# Altium schematic sheet Sensors.SchDoc
size A4; SheetNumber: 4; SheetTotal: 5
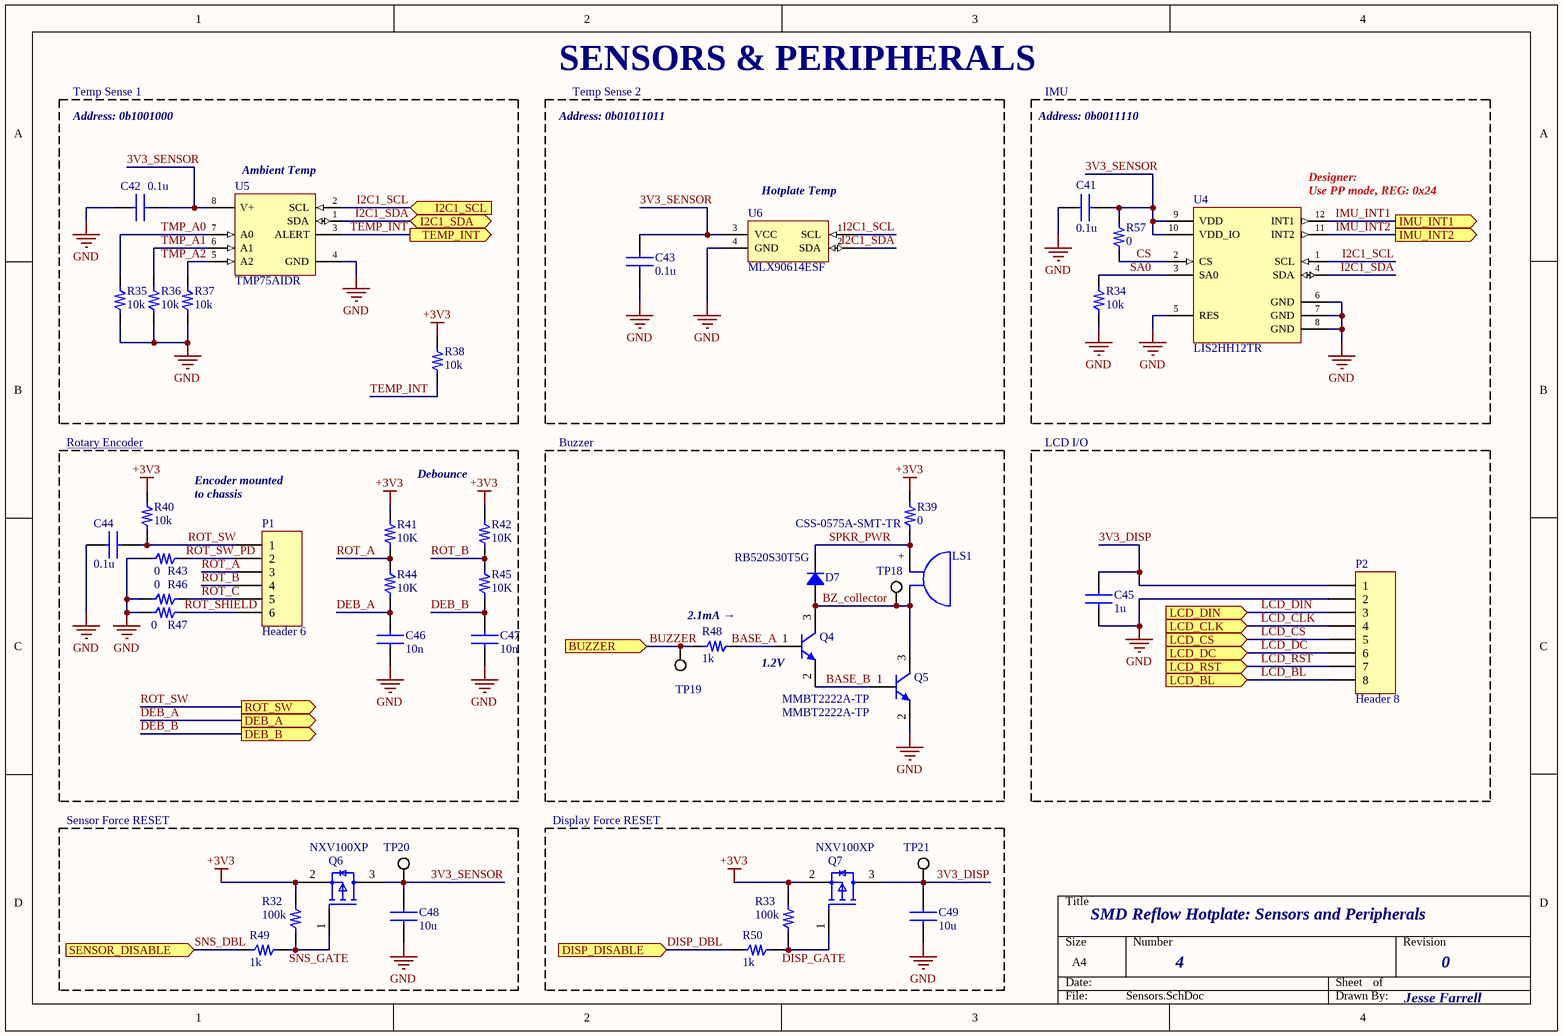
[diagram p0: Sensors.SchDoc]

## Parts
C41  0.1u  [FP-CL10-IPC_C]
C42  0.1u  [FP-CL10-IPC_C]
C43  0.1u  [FP-CL10-IPC_C]
C44  0.1u  [FP-CL10-IPC_C]
C45  1u  [FP-CL10-IPC_C]
C46  10n  [FP-CL10-IPC_C]
C47  10n  [FP-CL10-IPC_C]
C48  10u  [FP-CL10-IPC_C]
C49  10u  [FP-CL10-IPC_C]
D7  RB520S30T5G  [SOD-523]
LS1  CSS-0575A-SMT-TR  [CUI CSS-0575A-SMT-TR]
P1  Header 6  [HDR1X6]
P2  Header 8  [HDR1X8]
Q4  MMBT2222A-TP  [MCCSEMI SOT-23-3]
Q5  MMBT2222A-TP  [MCCSEMI SOT-23-3]
Q6  NXV100XP  [FP-SOT23-MFG - duplicate]
Q7  NXV100XP  [FP-SOT23-MFG - duplicate]
R32  100k  [FP-RMCF0603-MFG]
R33  100k  [FP-RMCF0603-MFG]
R34  10k  [FP-RMCF0603-MFG]
R35  10k  [FP-RMCF0603-MFG]
R36  10k  [FP-RMCF0603-MFG]
R37  10k  [FP-RMCF0603-MFG]
R38  10k  [FP-RMCF0603-MFG]
R39  0  [FP-RMCF0603-MFG]
R40  10k  [FP-RMCF0603-MFG]
R41  10K  [FP-RMCF0603-MFG]
R42  10K  [FP-RMCF0603-MFG]
R43  0  [FP-RMCF0603-MFG]
R44  10K  [FP-RMCF0603-MFG]
R45  10K  [FP-RMCF0603-MFG]
R46  0  [FP-RMCF0603-MFG]
R47  0  [FP-RMCF0603-MFG]
R48  1k  [FP-RMCF0603-MFG]
R49  1k  [FP-RMCF0603-MFG]
R50  1k  [FP-RMCF0603-MFG]
R57  0  [FP-RMCF0603-MFG]
TP18  TEST POINT  [KSTN-5003]  (value not drawn)
TP19  TEST POINT  [KSTN-5003]  (value not drawn)
TP20  TEST POINT  [KSTN-5003]  (value not drawn)
TP21  TEST POINT  [KSTN-5003]  (value not drawn)
U4  LIS2HH12TR  [STM-LGA-12]
U5  TMP75AIDR  [FP-D0008A-MFG]
U6  MLX90614ESF  [TO254P942H425-4]

## Blocks framed on the sheet
Temp Sense 1: C42 R35-R38 U5
Temp Sense 2: C43 U6
IMU: C41 R34 R57 U4
Rotary Encoder: C44 C46 C47 P1 R40-R47
Buzzer: D7 LS1 Q4 Q5 R39 R48 TP18 TP19
LCD I/O: C45 P2
Sensor Force RESET: C48 Q6 R32 R49 TP20
Display Force RESET: C49 Q7 R33 R50 TP21

## Ports
BUZZER (in), DEB_A (out), DEB_B (out), DISP_DISABLE (in), I2C1_SCL (in), I2C1_SDA (bidir), IMU_INT1 (out), IMU_INT2 (out), LCD_BL (in), LCD_CLK (in), LCD_CS (in), LCD_DC (in), LCD_DIN (in), LCD_RST (in), ROT_SW (out), SENSOR_DISABLE (in), TEMP_INT (out)

## Nets
+3V3: Q6.2(S) Q7.2(S) R32.2 R33.2 R38.1 R39.1 R40.1 R41.2 R42.2
GND: C41.1 C42.1 C43.1 C44.1 C45.1 C46.1 C47.1 C48.2 C49.2 P2.2 Q5.2(E) R34.2 R35.2 R36.2 R37.2 R43.1 R46.1 R47.1 U4.5(RES) U4.6(GND) U4.7(GND) U4.8(GND) U5.4(GND) U6.4(GND)
3V3_DISP: C45.2 C49.1 P2.1 Q7.3(D) TP21.1
3V3_SENSOR: C41.2 C42.2 C43.2 C48.1 Q6.3(D) R57.2 TP20.1 U4.9(VDD) U4.10(VDD_IO) U5.8(V+) U6.3(VCC)
BASE_A: Q4.1(B) R48.1
BASE_B: Q4.2(E) Q5.1(B)
BUZZER: R48.2 TP19.1 ; port BUZZER
BZ_collector: D7.1 LS1.- Q4.3(C) Q5.3(C) TP18.1
CS: R57.1 U4.2(CS)
DEB_A: C46.2 R44.2 ; port DEB_A
DEB_B: C47.2 R45.2 ; port DEB_B
DISP_DBL: R50.2 ; port DISP_DISABLE
DISP_GATE: Q7.1(G) R33.1 R50.1
I2C1_SCL: U4.1(SCL) U5.2(SCL) U6.1(SCL) ; port I2C1_SCL
I2C1_SDA: U4.4(SDA) U5.1(SDA) U6.2(SDA) ; port I2C1_SDA
IMU_INT1: U4.12(INT1) ; port IMU_INT1
IMU_INT2: U4.11(INT2) ; port IMU_INT2
LCD_BL: P2.8 ; port LCD_BL
LCD_CLK: P2.4 ; port LCD_CLK
LCD_CS: P2.5 ; port LCD_CS
LCD_DC: P2.6 ; port LCD_DC
LCD_DIN: P2.3 ; port LCD_DIN
LCD_RST: P2.7 ; port LCD_RST
ROT_A: P1.3 R41.1 R44.1
ROT_B: P1.4 R42.1 R45.1
ROT_C: P1.5 R46.2
ROT_SHIELD: P1.6 R47.2
ROT_SW: C44.2 P1.1 R40.2 ; port ROT_SW
ROT_SW_PD: P1.2 R43.2
SA0: R34.1 U4.3(SA0)
SNS_DBL: R49.2 ; port SENSOR_DISABLE
SNS_GATE: Q6.1(G) R32.1 R49.1
SPKR_PWR: D7.2 LS1.+ R39.2
TEMP_INT: R38.2 U5.3(ALERT) ; port TEMP_INT
TMP_A0: R35.1 U5.7(A0)
TMP_A1: R36.1 U5.6(A1)
TMP_A2: R37.1 U5.5(A2)

## Notes on the sheet
- SENSORS & PERIPHERALS
- Address: 0b1001000
- (near U5) Ambient Temp
- Address: 0b01011011
- Address: 0b0011110
- (near U6) Hotplate Temp
- (near U4) Designer:
  Use PP mode, REG: 0x24
- Encoder mounted
  to chassis
- Debounce
- 2.1mA →
- (near Q4) 1.2V
- SMD Reflow Hotplate: Sensors and Peripherals
- 4
- 0
- Jesse Farrell

## Library data of the parts
C41-C44 = CapTemplate0603: Cap Ceramic 0.1uF 16V X7R 10% SMD 0603; Supplier 1: Digi-Key; RoHS: Yes; Category: Ceramic Capacitors; Mount: Surface Mount; Case/Package: 0603; Case Code (Metric): 1608; Case Code (Imperial): 0603; Packaging: Tape and Reel; Capacitance: 0.1uF; Voltage Rating: 16V; Tolerance: 10%; Length: 0.063inch; Width: 0.031inch; Thickness: 0.035inch; ComponentLink1Description: DigikeyPart; ComponentLink1URL: https://www.digikey.ca/en/products/detail/samsung-electro-mechanics/CL10B104KO8NNNC/3886663
C45 = CapTemplate0603: Cap Ceramic 1uF 16V X5R 10% SMD 0603; Capacitance: 0.1uF; Supplier 1: Digi-Key; RoHS: Yes; Category: Ceramic Capacitors; Mount: Surface Mount; Case/Package: 0603; Case Code (Metric): 1608; Case Code (Imperial): 0603; Packaging: Tape and Reel; Voltage Rating: 16V; Tolerance: 10%; Length: 0.063inch; Width: 0.031inch; Thickness: 0.035inch; ComponentLink1Description: DigikeyPart; ComponentLink1URL: https://www.digikey.ca/en/products/detail/samsung-electro-mechanics/CL10B104KO8NNNC/3886663
C46 C47 = CapTemplate0603: Cap Ceramic 10nF 16V X7R 10% SMD 0603; Supplier 1: Digi-Key; RoHS: Yes; Category: Ceramic Capacitors; Mount: Surface Mount; Case/Package: 0603; Case Code (Metric): 1608; Case Code (Imperial): 0603; Packaging: Tape and Reel; Capacitance: 10nF; Voltage Rating: 16V; Tolerance: 10%; Length: 0.063inch; Width: 0.031inch; Thickness: 0.035inch; ComponentLink1Description: DigikeyPart; ComponentLink1URL: https://www.digikey.ca/en/products/detail/samsung-electro-mechanics/CL10B104KO8NNNC/3886663
C48 C49 = CapTemplate0603: Cap Ceramic 10uF 16V X5R 10% SMD 0603; Capacitance: 0.1uF; Supplier 1: Digi-Key; RoHS: Yes; Category: Ceramic Capacitors; Mount: Surface Mount; Case/Package: 0603; Case Code (Metric): 1608; Case Code (Imperial): 0603; Packaging: Tape and Reel; Voltage Rating: 16V; Tolerance: 10%; Length: 0.063inch; Width: 0.031inch; Thickness: 0.035inch; ComponentLink1Description: DigikeyPart; ComponentLink1URL: https://www.digikey.ca/en/products/detail/samsung-electro-mechanics/CL10B104KO8NNNC/3886663
D7 = RB520S30T5G: DIODE SCHOTTKY 30V 200MA SOD523; Manufacturer: ON Semiconductor; Current - Average Rectified (Io): 200mA (DC); Current - Reverse Leakage @ Vr: 1µA @ 10V; Speed: Small Signal =< 200mA (Io), Any Speed; Voltage - Forward (Vf) (Max) @ If: 600mV @ 200mA; Part Number: RB520S30T5G; ComponentLink1Description: Datasheet; ComponentLink1URL: https://www.onsemi.com/pub/Collateral/RB520S30T1-D.PDF; ComponentLink2Description: DigiKey Link; ComponentLink2URL: http://digikey.com/product-detail/en/on-semiconductor/RB520S30T5G/RB520S30T5GOSCT-ND/5213385; Diode Type: Schottky; LastUpdated: 2022-05-23 1:41:49 PM; Lifecycle Status: Active; Minimum Order: 1; Mounting Type: Surface Mount; Operating Temperature - Junction: -55°C ~ 150°C; Package / Case: SC-79, SOD-523; Packaging: TapeAndReel; PartId: 2811; Part Status: Active; Price: 0.02; Series: -; Supplier 1: DigiKey; Supplier Part Number 1: RB520S30T5GOSCT-ND; Supplier Device Package: SOD-523; Voltage - DC Reverse (Vr) (Max): 30V
LS1 = CSS-0575A-SMT-TR: AUDIO MAGNETIC XDCR 2-4V SMD; Manufacturer: CUI Devices; Current - Supply: 95mA; Driver Circuitry: Transducer, Externally Driven; Frequency: 4kHz; Input Type: Zero-Peak Signal; Operating Mode: Single Tone; Port Location: Top; Sound Pressure Level (SPL): 76dB @ 3V, 10cm; Voltage Range: 2 ~ 4V; Voltage - Rated: 3V; Part Number: CSS-0575A-SMT-TR; ComponentLink1Description: Datasheet; ComponentLink1URL: https://www.cuidevices.com/product/resource/digikeypdf/css-0575a-smt-tr.pdf; ComponentLink2Description: DigiKey Link; ComponentLink2URL: http://digikey.com/product-detail/en/cui-devices/CSS-0575A-SMT-TR/102-2201-1-ND/2364650; Height - Seated (Max): 0.094" (2.40mm); LastUpdated: 2020-04-24 12:39:31 AM; Lifecycle Status: Active; Minimum Order: 1; Mounting Type: Surface Mount; Operating Temperature: -30°C ~ 70°C; Packaging: TapeAndReel; Part Status: Active; Price: 1.50; Series: CSS; Size / Dimension: 0.197" L x 0.197" W (5.00mm x 5.00mm); Supplier 1: DigiKey; Supplier Part Number 1: 102-2201-1-ND; Technology: Magnetic; Termination: Solder Pads
P1 = Header 6: Header, 6-Pin; LatestRevisionDate: 17-Jul-2002; LatestRevisionNote: Re-released for DXP Platform.; Publisher: Altium Limited
P2 = Header 8: Header, 8-Pin; LatestRevisionDate: 17-Jul-2002; LatestRevisionNote: Re-released for DXP Platform.; Publisher: Altium Limited
Q4 Q5 = MMBT2222A-TP: TRANS NPN 40V 0.6A SOT23; Manufacturer: Micro Commercial Co; Current - Collector (Ic) (Max): 600 mA; DC Current Gain (hFE) (Min) @ Ic, Vce: 100 @ 150mA, 10V; Frequency - Transition: 300MHz; Power - Max: 350 mW; Vce Saturation (Max) @ Ib, Ic: 1V @ 50mA, 500mA; Part Number: MMBT2222A-TP; ComponentLink1Description: Datasheet; ComponentLink1URL: https://www.mccsemi.com/pdf/Products/MMBT2222A(SOT-23).pdf; ComponentLink2Description: DigiKey Link; ComponentLink2URL: https://www.digikey.com/en/products/detail/micro-commercial-co/MMBT2222A-TP/717279; LastUpdated: 2022-06-12 6:00:23 PM; Lifecycle Status: Active; Minimum Order: 1; Mounting Type: Surface Mount; Operating Temperature: -55°C ~ 150°C (TJ); Package / Case: TO-236-3, SC-59, SOT-23-3; Packaging: TapeAndReel; PartId: 259; Part Status: Active; Price: 0.02; Series: -; Supplier 1: DigiKey; Supplier Part Number 1: MMBT2222ATPMSCT-ND; Supplier Device Package: SOT-23; Transistor Type: NPN; Voltage - Collector Emitter Breakdown (Max): 40 V
Q6 Q7 = NXV100XPR: NXV100XP - 30 V, P-channel Trench MOSFET; Manufacturer: Nexperia; Supplier 1: Digi-Key; Manufacturer Part Number: NXV100XPR; RoHS: No; Category: Uncategorized; Stock 1: 1985; Supplier Part Number 1: 1727-NXV100XPRCT-ND
R32 R33 = ResTemplate0603: Res 0603 100K Ohm 1% 1/10W; Tolerance: ???%; Power Rating: ???mW; Resistance: ???; Supplier 1: Digi-Key; Category: Chip SMD Resistors; Mount: Surface Mount; Case/Package: 0603; Case Code (Metric): 1608; Case Code (Imperial): 0603; Number of Terminations: 2; Length: 0.061inch; Width: 0.031inch; Height: 0.022inch
R34-R38 R40-R42 R44 R45 = ResTemplate0603: Res 0603 10K Ohm 1% 1/10W; Tolerance: ???%; Power Rating: ???mW; Resistance: ???; Supplier 1: Digi-Key; Category: Chip SMD Resistors; Mount: Surface Mount; Case/Package: 0603; Case Code (Metric): 1608; Case Code (Imperial): 0603; Number of Terminations: 2; Length: 0.061inch; Width: 0.031inch; Height: 0.022inch
R39 R43 R46 R47 R57 = ResTemplate0603: Res 0603 0 Ohm 1% 1/10W; Tolerance: ???%; Power Rating: ???mW; Resistance: ???; Supplier 1: Digi-Key; Category: Chip SMD Resistors; Mount: Surface Mount; Case/Package: 0603; Case Code (Metric): 1608; Case Code (Imperial): 0603; Number of Terminations: 2; Length: 0.061inch; Width: 0.031inch; Height: 0.022inch
R48-R50 = ResTemplate0603: Res 0603 1K Ohm 1% 1/10W; Tolerance: ???%; Power Rating: ???mW; Resistance: ???; Supplier 1: Digi-Key; Category: Chip SMD Resistors; Mount: Surface Mount; Case/Package: 0603; Case Code (Metric): 1608; Case Code (Imperial): 0603; Number of Terminations: 2; Length: 0.061inch; Width: 0.031inch; Height: 0.022inch
TP18-TP21 = 5003: Test Point;  Miniature;  THM;  H .300;  Nylon 46 Insulated Orange;  PhosBronze/Silver; Manufacturer: Keystone Electronics; Body Material: PBT; Plating: Silver; Inside Diameter: 1.27mm; Outside Diameter: 2.54mm; Supplier 1: Digi-Key; Manufacturer Part Number: 5003; RoHS: Yes; Category: Connectors; Stock 1: 166018; Mount: PCB,Through Hole; Number of Pins: 1; Contact Material: Bronze; Contact Plating: Silver,Tin; Material: Nylon,Bronze,Silver; Color: Orange,White; Package Quantity: 10; Packaging: Bulk; Series: THM; Termination: Through Hole; Length: 7.62mm; Height: 0.3inch; REACH SVHC: No SVHC; Lead Free: Lead Free; RoHS Compliant: Yes; Flammability Rating: UL94 V-0; ComponentLink1URL: https://datasheet.ciiva.com/16885/70182825-16885788.pdf?src-supplier=Allied+Electronics; ComponentLink1Description: https://datasheet.ciiva.com/16885/70182825-16885788.pdf?src-supplier=Allied+Electronics; ComponentLink2URL: https://datasheet.ciiva.com/1454/1703983-1454826.pdf?src-supplier=Element14; ComponentLink2Description: https://datasheet.ciiva.com/1454/1703983-1454826.pdf?src-supplier=Element14; ComponentLink3URL: https://datasheet.ciiva.com/22631/1703983-22631103.pdf?src-supplier=Element14; ComponentLink3Description: https://datasheet.ciiva.com/22631/1703983-22631103.pdf?src-supplier=Element14; ComponentLink4URL: https://datasheet.ciiva.com/4598/5000-5004-4598618.pdf?src-supplier=Mouser; ComponentLink4Description: https://datasheet.ciiva.com/4598/5000-5004-4598618.pdf?src-supplier=Mouser; Supplier Part Number 1: 36-5003-ND
U4 = LIS2HH12TR: ACCELEROMETER 2-8G I2C/SPI 12LGA; Manufacturer: STMicroelectronics; Bandwidth: 400Hz; Output Type: SPI,I2C,Digital; Axis: X, Y, Z; Operating Supply Voltage: 3.6V; Supplier 1: Digi-Key; Manufacturer Part Number: LIS2HH12TR; RoHS: Yes; Category: Accelerometers; Stock 1: 6504; Mount: Surface Mount; Case/Package: LGA; Number of Pins: 12; Contact Plating: Gold; Min Operating Temperature: -40°C; Max Operating Temperature: 85°C; Packaging: Tape and Reel; Lead Free: Lead Free; RoHS Compliant: Yes; ComponentLink1URL: http://www.farnell.com/datasheets/2291204.pdf?src-supplier=Farnell; ComponentLink1Description: http://www.farnell.com/datasheets/2291204.pdf?src-supplier=Farnell; ComponentLink2URL: https://www.mouser.com/ds/2/389/lis2hh12-954953.pdf?src-supplier=Mouser; ComponentLink2Description: https://www.mouser.com/ds/2/389/lis2hh12-954953.pdf?src-supplier=Mouser; ComponentLink3URL: http://components.arrow.com/part/dataview/63232475S1079201N7728?src-supplier=Arrow+Electronics; ComponentLink3Description: http://components.arrow.com/part/dataview/63232475S1079201N7728?src-supplier=Arrow+Electronics; ComponentLink4URL: http://www.farnell.com/datasheets/2291204.pdf?src-supplier=Newark; ComponentLink4Description: http://www.farnell.com/datasheets/2291204.pdf?src-supplier=Newark; ComponentLink5URL: http://www.farnell.com/datasheets/2291204.pdf?src-supplier=Element14; ComponentLink5Description: http://www.farnell.com/datasheets/2291204.pdf?src-supplier=Element14; ComponentLink6URL: http://www.st.com/content/ccc/resource/technical/document/datasheet/c9/16/f2/79/ca/31/47/89/DM00096789.pdf/files/DM00096789.pdf/jcr:content/translations/en.DM00096789.pdf?src-supplier=Digi-Key; ComponentLink6Description: http://www.st.com/content/ccc/resource/technical/document/datasheet/c9/16/f2/79/ca/31/47/89/DM00096789.pdf/files/DM00096789.pdf/jcr:content/translations/en.DM00096789.pdf?src-supplier=Digi-Key; ComponentLink7URL: http://www.st.com/st-web-ui/static/active/en/resource/technical/document/datasheet/DM00096789.pdf?src-supplier=Avnet; ComponentLink7Description: http://www.st.com/st-web-ui/static/active/en/resource/technical/document/datasheet/DM00096789.pdf?src-supplier=Avnet; Supplier Part Number 1: 497-15069-1-ND
U5 = TMP75AIDR: Temperature Sensor Digital, Local -40°C ~ 125°C 11 b 8-SOIC; Manufacturer: Texas Instruments; Quiescent Current: 50uA; Min Supply Voltage: 2.7V; Max Supply Voltage: 5.5V; Interface: I2C,SMBus,2-Wire; Resolution: 12b; Operating Supply Current: 85uA; Number of Bits: 12; Output Current: 3mA; Nominal Supply Current: 410uA; Output Voltage: 400mV; Supplier 1: Digi-Key; Manufacturer Part Number: TMP75AIDR; RoHS: Yes; Category: Integrated Circuits (ICs); Mount: Surface Mount; Case/Package: SOIC; Number of Pins: 8; Weight: 0.002677oz; Contact Plating: Gold; Min Operating Temperature: -40°C; Max Operating Temperature: 125°C; Packaging: Tape and Reel; Package Quantity: 1; Max Supply Voltage (DC): 5.5V; Min Supply Voltage (DC): 2.7V; Output Type: Digital; Termination: SMD/SMT; Radiation Hardening: No; Lead Free: Lead Free; RoHS Compliant: Yes; REACH SVHC: No SVHC; ComponentLink1URL: https://datasheet.ciiva.com/15098/getdatasheetpartid-313967-15098447.pdf?src-supplier=Verical; ComponentLink1Description: https://datasheet.ciiva.com/15098/getdatasheetpartid-313967-15098447.pdf?src-supplier=Verical; ComponentLink2URL: https://datasheet.ciiva.com/46395/1836472-46395973.pdf?src-supplier=Element14; ComponentLink2Description: https://datasheet.ciiva.com/46395/1836472-46395973.pdf?src-supplier=Element14; ComponentLink3URL: https://datasheet.ciiva.com/2002/tmp175-2002986.pdf?src-supplier=Digi-Key; ComponentLink3Description: https://datasheet.ciiva.com/2002/tmp175-2002986.pdf?src-supplier=Digi-Key; ComponentLink4URL: https://datasheet.ciiva.com/2002/tmp175-2002985.pdf?src-supplier=Digi-Key; ComponentLink4Description: https://datasheet.ciiva.com/2002/tmp175-2002985.pdf?src-supplier=Digi-Key; ComponentLink5URL: https://datasheet.ciiva.com/2002/tmp175-2002987.pdf?src-supplier=Digi-Key; ComponentLink5Description: https://datasheet.ciiva.com/2002/tmp175-2002987.pdf?src-supplier=Digi-Key; ComponentLink6URL: https://datasheet.ciiva.com/1514/1836472-1514144.pdf?src-supplier=Element14; ComponentLink6Description: https://datasheet.ciiva.com/1514/1836472-1514144.pdf?src-supplier=Element14; ComponentLink7URL: https://datasheet.ciiva.com/1514/1836472-1514145.pdf?src-supplier=Element14; ComponentLink7Description: https://datasheet.ciiva.com/1514/1836472-1514145.pdf?src-supplier=Element14; Supplier Part Number 1: 296-17838-1-ND
U6 = MLX90614ESF-BAA-000-TU: Temp Sensor Digital Serial (2-Wire) 4-Pin TO-39 Can; Manufacturer: Melexis; Max Output Current: 11mA; Operating Supply Voltage: 3.6V; Resolution: 16b; Output Type: PWM; Sensing Method: Infrared (IR); Supplier 1: Digi-Key; Manufacturer Part Number: MLX90614ESF-BAA-000-TU; RoHS: Yes; Category: Temperature and Humidity Sensors; Stock 1: 1365; Case/Package: TO-39-4; Min Operating Temperature: -40°C; Max Operating Temperature: 85°C; Package Quantity: 55; Packaging: Tray; Lead Free: Lead Free; RoHS Compliant: Yes; ComponentLink1URL: http://www.mouser.com/ds/2/734/MLX90614-Datasheet-Melexis-953298.pdf?src-supplier=Mouser; ComponentLink1Description: http://www.mouser.com/ds/2/734/MLX90614-Datasheet-Melexis-953298.pdf?src-supplier=Mouser; ComponentLink2URL: https://www.melexis.com/-/media/files/documents/datasheets/mlx90614-datasheet-melexis.pdf?src-supplier=Digi-Key; ComponentLink2Description: https://www.melexis.com/-/media/files/documents/datasheets/mlx90614-datasheet-melexis.pdf?src-supplier=Digi-Key; ComponentLink3URL: http://www.melexis.com/Asset/IR-sensor-thermometer-MLX90614-Datasheet-DownloadLink-5152.aspx?src-supplier=Future+Electronics; ComponentLink3Description: http://www.melexis.com/Asset/IR-sensor-thermometer-MLX90614-Datasheet-DownloadLink-5152.aspx?src-supplier=Future+Electronics; Supplier Part Number 1: MLX90614ESF-BAA-000-TU-ND